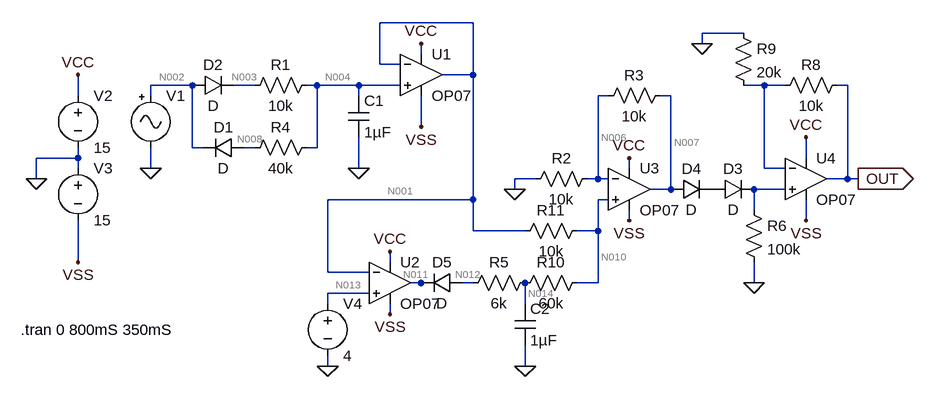
[diagram p0: schematic EG.asc]
EG.asc, the LTspice schematic file:
Version 4
SHEET 1 1140 724
WIRE 112 176 -32 176
WIRE 528 192 464 192
WIRE 464 208 464 192
WIRE 32 224 32 208
WIRE -32 240 -32 176
WIRE 0 240 -32 240
WIRE 112 256 112 176
WIRE 112 256 64 256
WIRE -320 272 -384 272
WIRE -224 272 -256 272
WIRE -128 272 -144 272
WIRE -64 272 -128 272
WIRE 0 272 -64 272
WIRE 560 272 528 272
WIRE 592 272 560 272
WIRE 688 272 672 272
WIRE -496 288 -496 256
WIRE -384 288 -384 272
WIRE -64 288 -64 272
WIRE 320 288 304 288
WIRE 416 288 400 288
WIRE 32 336 32 288
WIRE -320 368 -320 272
WIRE -304 368 -320 368
WIRE -224 368 -240 368
WIRE -128 368 -128 272
WIRE -128 368 -144 368
WIRE -496 384 -496 368
WIRE -496 384 -560 384
WIRE 624 384 624 352
WIRE -496 400 -496 384
WIRE -384 400 -384 368
WIRE -64 400 -64 352
WIRE 352 400 352 384
WIRE 560 400 560 272
WIRE 592 400 560 400
WIRE -560 416 -560 384
WIRE 208 416 176 416
WIRE 304 416 304 288
WIRE 304 416 288 416
WIRE 320 416 304 416
WIRE 688 416 688 272
WIRE 688 416 656 416
WIRE 704 416 688 416
WIRE 176 432 176 416
WIRE 416 432 416 288
WIRE 416 432 384 432
WIRE 432 432 416 432
WIRE 592 432 544 432
WIRE 112 448 112 256
WIRE 112 448 -112 448
WIRE 320 448 304 448
WIRE 544 464 544 432
WIRE 352 480 352 464
WIRE 624 480 624 448
WIRE 112 496 112 448
WIRE 192 496 112 496
WIRE 304 496 304 448
WIRE 304 496 272 496
WIRE -496 544 -496 480
WIRE -16 544 -16 528
WIRE -112 560 -112 448
WIRE -48 560 -112 560
WIRE 32 576 16 576
WIRE 48 576 32 576
WIRE 112 576 96 576
WIRE 304 576 304 496
WIRE 304 576 272 576
WIRE 544 576 544 544
WIRE -48 592 -112 592
WIRE -112 608 -112 592
WIRE 192 608 192 576
WIRE -16 624 -16 608
WIRE -112 704 -112 688
WIRE 192 704 192 672
FLAG -64 400 0
FLAG -384 400 0
FLAG -560 416 0
FLAG -496 256 VCC
FLAG -496 544 VSS
FLAG 32 208 VCC
FLAG 32 336 VSS
FLAG -112 704 0
FLAG 352 384 VCC
FLAG 352 480 VSS
FLAG -16 528 VCC
FLAG -16 624 VSS
FLAG 176 432 0
FLAG 192 704 0
FLAG 624 352 VCC
FLAG 624 480 VSS
FLAG 704 416 OUT
IOPIN 704 416 Out
FLAG 544 576 0
FLAG 464 208 0
SYMBOL Opamps\\OP07 32 192 R0
SYMATTR InstName U1
SYMBOL cap -80 288 R0
SYMATTR InstName C1
SYMATTR Value 1µF
SYMBOL res -128 256 R90
WINDOW 0 0 56 VBottom 2
WINDOW 3 32 56 VTop 2
SYMATTR InstName R1
SYMATTR Value 10k
SYMBOL diode -240 352 R90
WINDOW 0 0 32 VBottom 2
WINDOW 3 32 32 VTop 2
SYMATTR InstName D1
SYMBOL Misc\\signal -384 272 R0
WINDOW 3 24 104 Invisible 2
WINDOW 123 0 0 Left 2
WINDOW 39 0 0 Left 2
SYMATTR Value PULSE(0 5 0 1uS 1uS 200mS 400mS)
SYMATTR InstName V1
SYMBOL voltage -496 272 R0
WINDOW 123 0 0 Left 2
WINDOW 39 0 0 Left 2
SYMATTR InstName V2
SYMATTR Value 15
SYMBOL voltage -496 384 R0
WINDOW 123 0 0 Left 2
WINDOW 39 0 0 Left 2
SYMATTR InstName V3
SYMATTR Value 15
SYMBOL Opamps\\OP07 -16 512 R0
SYMATTR InstName U2
SYMBOL voltage -112 592 R0
WINDOW 123 0 0 Left 2
WINDOW 39 0 0 Left 2
SYMATTR InstName V4
SYMATTR Value 4
SYMBOL Opamps\\OP07 352 368 R0
SYMATTR InstName U3
SYMBOL res 304 400 R90
WINDOW 0 0 56 VBottom 2
WINDOW 3 32 56 VTop 2
SYMATTR InstName R2
SYMATTR Value 10k
SYMBOL res 416 272 R90
WINDOW 0 0 56 VBottom 2
WINDOW 3 32 56 VTop 2
SYMATTR InstName R3
SYMATTR Value 10k
SYMBOL diode 96 560 R90
WINDOW 0 0 32 VBottom 2
WINDOW 3 32 32 VTop 2
SYMATTR InstName D5
SYMBOL res 288 560 R90
WINDOW 0 0 56 VBottom 2
WINDOW 3 32 56 VTop 2
SYMATTR InstName R10
SYMATTR Value 60k
SYMBOL res 288 480 R90
WINDOW 0 0 56 VBottom 2
WINDOW 3 32 56 VTop 2
SYMATTR InstName R11
SYMATTR Value 10k
SYMBOL diode -320 288 R270
WINDOW 0 32 32 VTop 2
WINDOW 3 0 32 VBottom 2
SYMATTR InstName D2
SYMBOL res -128 352 R90
WINDOW 0 0 56 VBottom 2
WINDOW 3 32 56 VTop 2
SYMATTR InstName R4
SYMATTR Value 40k
SYMBOL res 208 560 R90
WINDOW 0 0 56 VBottom 2
WINDOW 3 32 56 VTop 2
SYMATTR InstName R5
SYMATTR Value 6k
SYMBOL cap 176 608 R0
SYMATTR InstName C2
SYMATTR Value 1µF
SYMBOL diode 480 448 R270
WINDOW 0 32 32 VTop 2
WINDOW 3 0 32 VBottom 2
SYMATTR InstName D3
SYMBOL Opamps\\OP07 624 352 R0
SYMATTR InstName U4
SYMBOL res 528 448 R0
SYMATTR InstName R6
SYMATTR Value 100k
SYMBOL res 512 176 R0
SYMATTR InstName R9
SYMATTR Value 20k
SYMBOL res 688 256 R90
WINDOW 0 0 56 VBottom 2
WINDOW 3 32 56 VTop 2
SYMATTR InstName R8
SYMATTR Value 10k
SYMBOL diode 416 448 R270
WINDOW 0 32 32 VTop 2
WINDOW 3 0 32 VBottom 2
SYMATTR InstName D4
TEXT -584 648 Left 2 !.tran 0 800mS 350mS

The netlist it stands for:
* EG.asc
XU1 N004 N001 VCC VSS N001 LT1001  ; OP07, pins In+ In- V+ V- OUT
C1 N004 0 1µF
R1 N004 N003 10k
D1 N008 N002 D
V1 N002 0 PULSE(0 5 0 1uS 1uS 200mS 400mS)
V2 VCC 0 15
V3 0 VSS 15
XU2 N013 N001 VCC VSS N011 LT1001  ; OP07, pins In+ In- V+ V- OUT
V4 N013 0 4
XU3 N010 N006 VCC VSS N007 LT1001  ; OP07, pins In+ In- V+ V- OUT
R2 N006 0 10k
R3 N007 N006 10k
D5 N012 N011 D
R10 N010 N014 60k
R11 N010 N001 10k
D2 N002 N003 D
R4 N004 N008 40k
R5 N014 N012 6k
C2 N014 0 1µF
D3 P001 N009 D
XU4 N009 N005 VCC VSS OUT LT1001  ; OP07, pins In+ In- V+ V- OUT
R6 N009 0 100k
R9 0 N005 20k
R8 OUT N005 10k
D4 N007 P001 D
.model D D
.lib standard.dio
.tran 0 800mS 350mS
.lib LTC.lib
.backanno
.end

* Results of the author's LTspice run, read from the files saved beside the schematic
* Operating Point, zero values left out:
*   V(n001) = 289.3 µV
*   V(n004) = 289.2 µV
*   V(vcc) = 15 V
*   V(vss) = -15 V
*   V(n003) = 289.2 µV
*   V(n008) = 289.2 µV
*   V(n013) = 4 V
*   V(n011) = 14.07 V
*   V(n006) = 289.5 µV
*   V(n010) = 289.5 µV
*   V(n007) = 578.9 µV
*   V(n012) = 290.4 µV
*   V(n014) = 290.3 µV
*   V(p001) = 289.5 µV
*   I(D5) = -14.08 pA
*   I(R5) = -14.08 pA
*   I(R11) = 14.08 pA
*   I(R10) = -14.08 pA
*   I(R3) = 28.95 nA
*   I(R2) = 28.95 nA
*   I(V4) = -2.174 mA
*   I(V3) = -10.22 mA
*   I(V2) = -8.041 mA
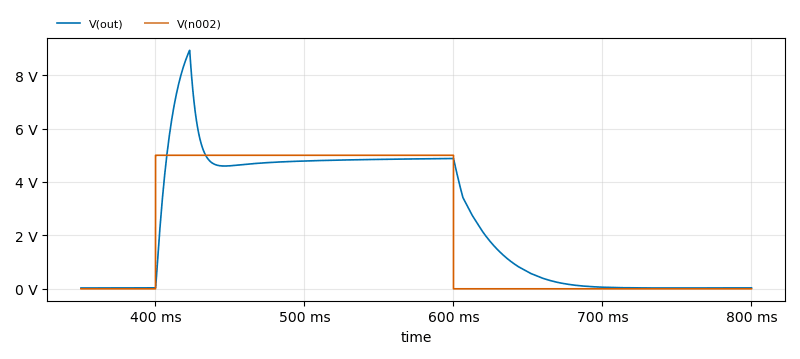
[diagram p1: Transient Analysis of EG.asc, plotted from the saved traces]
* Transient Analysis, 1 run:
*   V(out): min 30.14 mV, max 8.929 V, average 2.48 V, rms 3.482 V, last 34.61 mV
*   V(n002): min 0 V, max 5 V, average 2.222 V, rms 3.333 V, last 0 V